# EAGLE design Adafruit PiMiniTFT 240x240 (EAGLE 9.5.2)
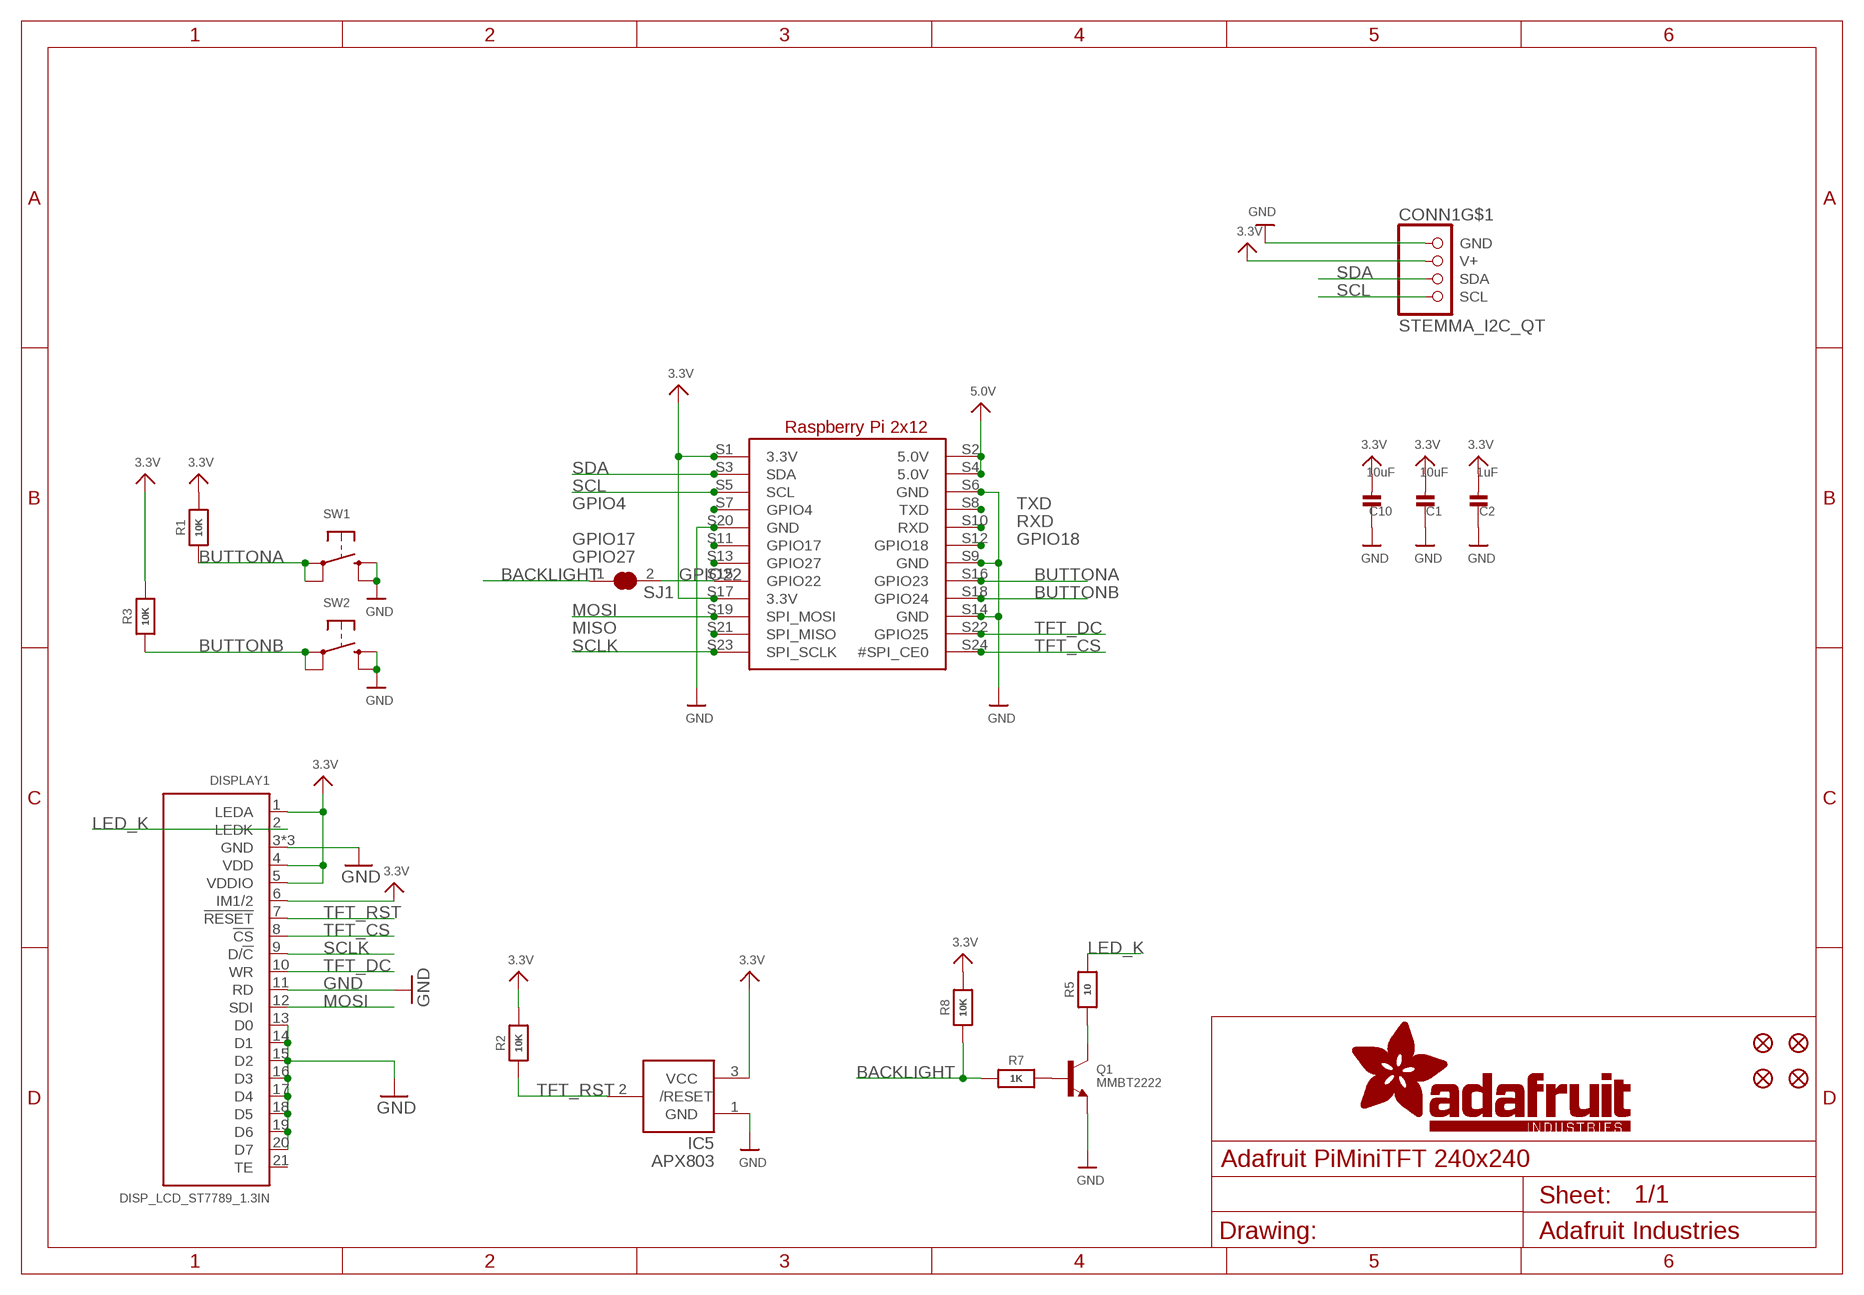
[diagram p0: schematic, sheet 1]

## Parts
C1  10uF  CAP_CERAMIC0805-NOOUTLINE  [0805-NO]
C2  1uF  CAP_CERAMIC0603_NO  [0603-NO]
C10  10uF  CAP_CERAMIC0805-NOOUTLINE  [0805-NO]
CONN1  STEMMA_I2C_QT  [JST_SH4]
DISPLAY1  DISP_LCD_ST7789_1.3IN  [TFT_1.3IN_240X240_24P]
FID1  FIDUCIAL_1MM  [FIDUCIAL_1MM]
FID2  FIDUCIAL_1MM  [FIDUCIAL_1MM]
FID3  FIDUCIAL_1MM  [FIDUCIAL_1MM]
FID4  FIDUCIAL_1MM  [FIDUCIAL_1MM]
IC5  APX803  AXP083-SAG  [SOT23]
Q1  MMBT2222  TRANSISTOR_NPNWIDE  [SOT23-WIDE]
R1  10K  RESISTOR_0603_NOOUT  [0603-NO]
R2  10K  RESISTOR_0603_NOOUT  [0603-NO]
R3  10K  RESISTOR_0603_NOOUT  [0603-NO]
R5  10  RESISTOR_0603_NOOUT  [0603-NO]
R7  1K  RESISTOR_0603_NOOUT  [0603-NO]
R8  10K  RESISTOR_0603_NOOUT  [0603-NO]
RASPI1  RASPBERRYPI_2X12_SMT  [RASPBERRYPI_2X12_SMT]
SJ1  SOLDERJUMPER_CLOSED  [SOLDERJUMPER_CLOSEDWIRE]
SW1  SWITCH_TACT_SMT_EVQQ2_SMALL  [EVQ-Q2_SMALLER]
SW2  SWITCH_TACT_SMT_EVQQ2_SMALL  [EVQ-Q2_SMALLER]

## Nets
3.3V: C1.2 C2.2 C10.2 CONN1.2(V+) DISPLAY1.1(LEDA) DISPLAY1.4(VDD) DISPLAY1.5(VDDIO) DISPLAY1.6(IM1/2) IC5.3(VCC) R1.2 R2.2 R3.2 R8.2 RASPI1.S1(3.3V) RASPI1.S17(3.3V)
5.0V: RASPI1.S2(5.0V) RASPI1.S4(5.0V)
BACKLIGHT: R7.1 R8.1 SJ1.1
BUTTONA: R1.1 RASPI1.S16(GPIO23) SW1.A'(P1) SW1.A(P)
BUTTONB: R3.1 RASPI1.S18(GPIO24) SW2.A'(P1) SW2.A(P)
GND: C1.1 C2.1 C10.1 CONN1.1(GND) DISPLAY1.3(GND) DISPLAY1.11(RD) DISPLAY1.13(D0) DISPLAY1.14(D1) DISPLAY1.15(D2) DISPLAY1.16(D3) DISPLAY1.17(D4) DISPLAY1.18(D5) DISPLAY1.19(D6) DISPLAY1.20(D7) DISPLAY1.23(GND) DISPLAY1.24(GND) IC5.1(GND) Q1.2(E) RASPI1.S6(GND) RASPI1.S9(GND) RASPI1.S14(GND) RASPI1.S20(GND) SW1.B'(S1) SW1.B(S) SW2.B'(S1) SW2.B(S)
GPIO4: RASPI1.S7(GPIO4)
GPIO17: RASPI1.S11(GPIO17)
GPIO18: RASPI1.S12(GPIO18)
GPIO22: RASPI1.S15(GPIO22) SJ1.2
GPIO27: RASPI1.S13(GPIO27)
LED_K: DISPLAY1.2(LEDK) R5.2
MISO: RASPI1.S21(SPI_MISO)
MOSI: DISPLAY1.12(SDI) RASPI1.S19(SPI_MOSI)
N$1: Q1.1(B) R7.2
N$5: Q1.3(C) R5.1
RXD: RASPI1.S10(RXD)
SCL: CONN1.4(SCL) RASPI1.S5(SCL)
SCLK: DISPLAY1.9(D/!C) RASPI1.S23(SPI_SCLK)
SDA: CONN1.3(SDA) RASPI1.S3(SDA)
TFT_CS: DISPLAY1.8(!CS) RASPI1.S24(#SPI_CE0)
TFT_DC: DISPLAY1.10(WR) RASPI1.S22(GPIO25)
TFT_RST: DISPLAY1.7(!RESET) IC5.2(/RESET) R2.1
TXD: RASPI1.S8(TXD)
Unconnected: CONN1.MT1(MT) CONN1.MT2(MT) DISPLAY1.21(TE)

## Library data of the parts
C1 C2 C10 = microbuilder:CAP_CERAMIC: Ceramic Capacitors For new designs, use the packages preceded by an '_' character since they are more reliable: The following footprints should be used on most boards: _0402 - Standard footprint for regular board layouts _0603 - Standard footprint for regular board layouts _0805 - Standard footprint for regular board layouts _1206 - Standard footprint for regular board layouts For extremely tight-pitch boards where space is at a premium, the following 'micro-pitch' footprints can be used (smaller pads, no silkscreen outline, etc.): _0402MP - Micro-pitch footprint for very dense/compact boards _0603MP - Micro-pitch footprint for very dense/compact boards _0805MP - Micro-pitch footprint for very dense/compact boards _1206MP - Micro-pitch footprint for very dense/compact boards
CONN1 = microbuilder:STEMMA_I2C
DISPLAY1 = microbuilder:DISP_LCD_ST7789_1.3IN
FID1-FID4 = microbuilder:FIDUCIAL: Fiducial Alignment Points Various fiducial points for machine vision alignment.; BOM: EXCLUDE
IC5 = adafruit:AXP083
Q1 = microbuilder:TRANSISTOR_NPN: NPN Transistor Transistor (NPN) 500mA 45V - BC817 [Digikey: 568-1631-1-ND] Transistor (NPN) 500mA 45V - BC817,215 [Mouser: 771-BC817-T/R] SOT23-R - SOT23 footprint optimised for use with solder paste and reflow ovens. SOT23-W - SOT23 footprint optimised for hand-soldering (larger pads).
R1-R3 R5 R7 R8 = microbuilder:RESISTOR: Resistors For new designs, use the packages preceded by an '_' character since they are more reliable: The following footprints should be used on most boards: _0402 - Standard footprint for regular board layouts _0603 - Standard footprint for regular board layouts _0805 - Standard footprint for regular board layouts _1206 - Standard footprint for regular board layouts For extremely tight-pitch boards where space is at a premium, the following 'micro-pitch' footprints can be used (smaller pads, no silkscreen outline, etc.): _0402MP - Micro-pitch footprint for very dense/compact boards _0603MP - Micro-pitch footprint for very dense/compact boards _0805MP - Micro-pitch footprint for very dense/compact boards _1206MP - Micro-pitch footprint for very dense/compact boards
RASPI1 = adafruit_sbc:RASPBERRYPI_2X12
SJ1 = microbuilder:SOLDERJUMPER_CLOSED: Solder Jumper - Closed These solder jumpers are closed by default CLOSEDWIRE - 10 mil trace between pads that can be cut and resoldered later CLOSEDPERM - 63 mil trace between pads for a permanent connection (used to 'bridge' two signals, a shameless hack for Eagle). Can double as a test point as well (no cream layer)
SW1 SW2 = microbuilder:SWITCH_TACT_SMT: SMT Tact Switches 6x6mm - Digikey: P12940SCT-ND KMR2 (4.6x2.8mm) - Digikey: 401-1426-1-ND EVQ-PQHB55 - Light Touch, 160GF (4.5x4.5mm) - Digikey: P8090SCT-ND KMT0 - KMT021 NGJ LHS (etc.) IP68/Waterproof - Digikey: CKN10289CT-ND

## Net classes
1 power: width 0.254 mm

## Board
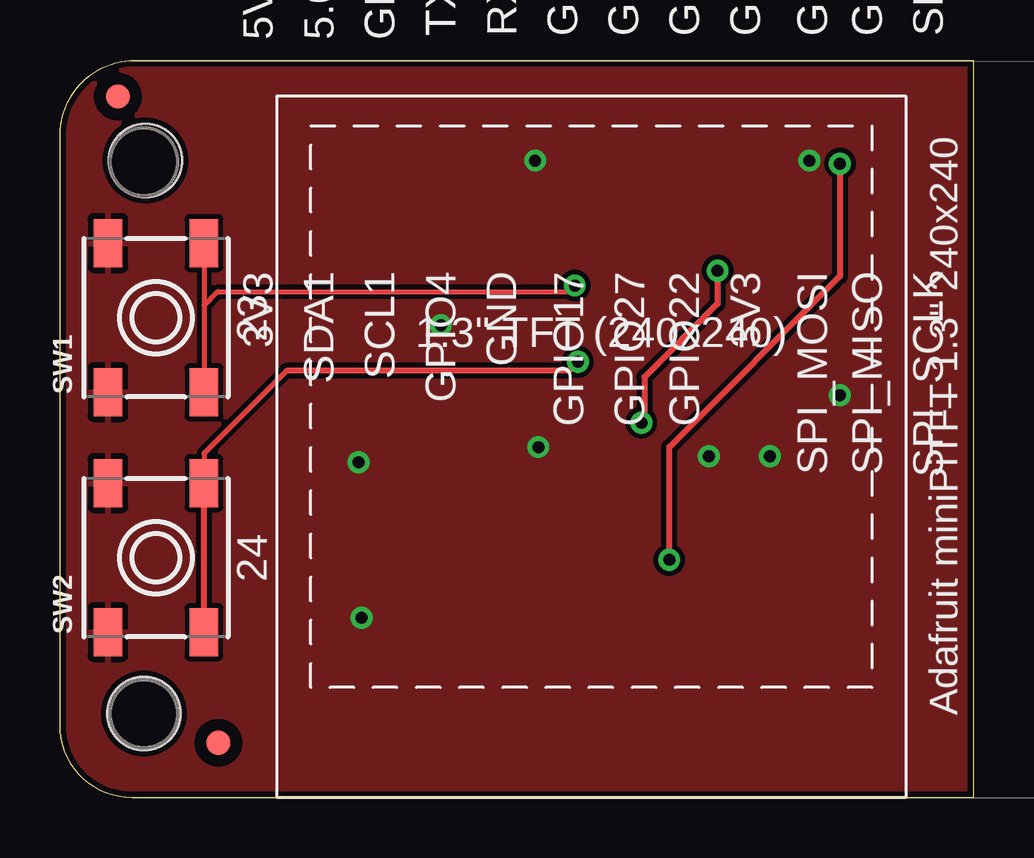
[diagram p1: board, top side]
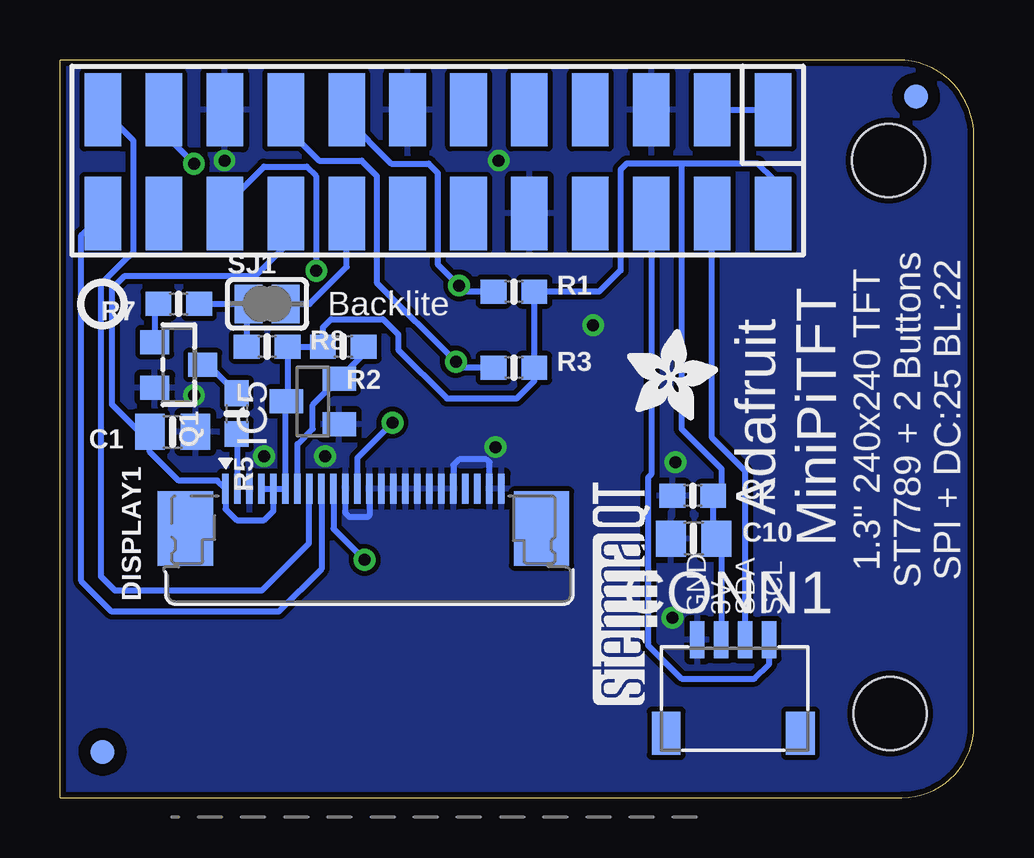
[diagram p2: board, bottom side, seen from below]

Size 38.1 x 30.73 mm. Coordinates in mm from the lower left corner, seen from the top.
Outline: 38.1,0 3,0 arc-90 0,3 0,27.56 arc-90 3.17,30.73 38.1,30.73 38.1,0
Copper layers (1*16): Top 0.035mm / dielectric 1.5mm / Bottom 0.035mm
Design rules "adafruit *": minimum track width 8mil, minimum drill 15.5mil, track to track 8mil, track to pad 8mil, pad to pad 8mil, via to via 8mil, smd to smd 8mil, copper to edge 10mil, drill to drill 8mil, minimum pad ring 10mil, minimum via ring 8mil, stop-mask expansion 2mil, vias tented up to drill 20mil, thermal gap 10mil
Holes 3.05 mm at 3.56,26.54 3.5,3.5

### Footprints (pad centres in the part's own frame; a part is rotated, then mirrored left to right if it is on the bottom)
0805-NO = smd 1.24 x 1.5: 1 -0.95,0; 2 0.95,0
0603-NO = smd 1.075 x 1: 1 -0.85,0; 2 0.85,0
JST_SH4 = smd 0.6 x 1.55: 1 -1.5,2.514; 2 -0.5,2.514; 3 0.5,2.514; 4 1.5,2.514 | smd 1.2 x 1.8: MT1 -2.8,-1.386; MT2 2.8,-1.386
TFT_1.3IN_240X240_24P = smd 0.28 x 1.25: 1 4.55,13.378; 2 5.05,13.378; 3 5.55,13.378; 4 6.05,13.378; 5 6.55,13.378; 6 7.05,13.378; 7 7.55,13.378; 8 8.05,13.378; 9 8.55,13.378; 10 9.05,13.378; 11 9.55,13.378; 12 10.05,13.378; 13 10.55,13.378; 14 11.05,13.378; 15 11.55,13.378; 16 12.05,13.378; 17 12.55,13.378; 18 13.05,13.378; 19 13.55,13.378; 20 14.05,13.378; 21 14.55,13.378; 22 15.05,13.378; 23 15.55,13.378; 24 16.05,13.378 | smd 2.3 x 3.1: MNT1 2.88,11.722; MNT2 17.72,11.722
FIDUCIAL_1MM = smd 1 x 1: 1 0,0
SOT23 = smd 1 x 1.4: 1 -0.95,-1.1; 2 0.95,-1.1; 3 0,1.1
SOT23-WIDE = smd 1 x 1.2: 1 -0.95,-1; 2 0.95,-1; 3 0,1
RASPBERRYPI_2X12_SMT = smd 1.524 x 3.048 bottom: S1 8.37,24.339; S2 8.37,28.657; S3 10.91,24.339; S4 10.91,28.657; S5 13.45,24.339; S6 13.45,28.657; S7 15.99,24.339; S8 15.99,28.657; S9 18.53,24.339; S10 18.53,28.657; S11 21.07,24.339; S12 21.07,28.657; S13 23.61,24.339; S14 23.61,28.657; S15 26.15,24.339; S16 26.15,28.657; S17 28.69,24.339; S18 28.69,28.657; S19 31.23,24.339; S20 31.23,28.657; S21 33.77,24.339; S22 33.77,28.657; S23 36.31,24.339; S24 36.31,28.657
SOLDERJUMPER_CLOSEDWIRE = smd 1.168 x 1.6: 1 -0.762,0; 2 0.762,0 | smd 0.635 x 0.203: WIRE 0,0
EVQ-Q2_SMALLER = smd 2 x 1.2: A -3.1,-2; A' 3.1,-2; B -3.1,2; B' 3.1,2

### Placement (x,y rotation side)
C1  33.4,15.24 180 bottom
C2  11.72,12.57 0 bottom
C10  11.68,10.79 0 bottom
CONN1  10.03,4.06 0 bottom
DISPLAY1  35.75,-0.51 0 bottom
FID1  2.41,29.21 0 top
FID2  6.6,2.29 0 top
FID3  36.32,1.9 0 bottom
FID4  2.41,29.21 0 bottom
IC5  27.56,16.51 90 bottom
Q1  33.15,18.03 270 bottom
R1  19.18,21.08 0 bottom
R2  26.29,18.8 180 bottom
R3  19.18,17.91 0 bottom
R5  30.73,16 270 bottom
R7  33.15,20.57 180 bottom
R8  29.46,18.8 0 bottom
RASPI1  0,0 0 top
SJ1  29.46,20.57 0 bottom
SW1  4,20 90 top
SW2  4,10 90 top
U$4  MICROSD  [ADAFRUIT_3.5MM]  14.47,15.72 0 bottom
U$6  [PCBFEAT-REV-040]  36.32,20.57 0 bottom
U$15  [STEMMAQT]  13.23,3.88 90 bottom

### Tracks (layer width: path | path; a pad name or v marks a point on that pad's centre or on a via)
3.3V
  Bottom 0.254: DISPLAY1.4 DISPLAY1.5 | DISPLAY1.5 DISPLAY1.6 28.7,16.47 IC5.3 28.61,16.55 R8.2 R2.2 27.14,19.6 26.8,19.94 24.64,19.94 24,19.3 24,18.67 21.97,16.64 19.05,16.64 18.33,17.36 R3.2 R1.2 15.62,21.08 14.73,21.97 14.73,26.16 14.48,26.42 12.19,26.42 | DISPLAY1.5 29.2,11.95 29.59,11.56 30.73,11.56 31.2,12.02 DISPLAY1.1 31.54,13.21 33.15,13.21 34.35,14.41 C1.2 34.8,15.24 35.94,16.38 35.94,21.21 35.43,21.72 29.97,21.72 28.69,23 RASPI1.S17 | CONN1.2 10.53,10.59 C10.2 10.87,10.93 C2.2 10.52,12.93 10.52,13.7 12.19,15.37 12.19,26.42 | RASPI1.S1 8.37,25.77 9.02,26.42 12.19,26.42 | RASPI1.S17
5.0V
  Bottom 0.254: RASPI1.S4 RASPI1.S2
BACKLIGHT
  Bottom 0.254: R8.1 30.31,20.49 SJ1.1 R7.1
BUTTONA  (via drill 0.5)
  Top 0.203: SW1.A' 6,20.5 | 6,20.5 SW1.A | 6,20.5 6.58,21.08 21.21,21.08
  Top 0.254: 21.21,21.08 v21.46,21.34
  Bottom 0.254: R1.1 21.21,21.08 v21.46,21.34 22.35,22.23 22.35,26.04 22.73,26.42 24.29,26.42 26.15,28.28 RASPI1.S16
BUTTONB  (via drill 0.5)
  Top 0.203: 9.44,17.78 6,14.34 SW2.A'
  Top 0.254: SW2.A SW2.A' | v21.59,18.16 21.21,17.78 9.44,17.78
  Bottom 0.254: R3.1 21.34,17.91 v21.59,18.16 24.89,21.46 24.89,25.91 25.53,26.54 27.3,26.54 28.69,27.93 RASPI1.S18 | RASPI1.S18
GND  (via drill 0.5)
  Bottom 0.254: DISPLAY1.13 25.2,11.76 25.27,11.68 26.03,11.68 26.2,11.85 DISPLAY1.11 | DISPLAY1.23 20.19,13.97 20.32,14.1 21.46,14.1 21.7,13.86 DISPLAY1.20
  other vias: 12.45,13.97 12.57,7.49 19.94,14.61 29.59,14.22 27.05,14.22 15.88,19.69 32.51,16.76 19.81,26.54 31.24,26.54
  pour Bottom: 0,30.73 37.97,30.73 37.97,0 0,0
  pour Top: 0,30.73 37.97,30.73 37.97,0 0,0
GPIO22
  Bottom 0.254: SJ1.2 27.69,20.57 26.15,22.11 RASPI1.S15
LED_K
  Bottom 0.254: DISPLAY1.2 30.7,15.12 R5.2
MOSI  (via drill 0.5)
  Top 0.254: v24.24,15.62 24.36,15.75 24.36,17.52 27.41,20.57 v27.41,21.95
  Bottom 0.254: DISPLAY1.12 25.7,14.16 v24.24,15.62 | RASPI1.S19 31.23,24.65 29.59,26.29 27.81,26.29 27.43,25.91 27.43,22.23 27.56,22.1 v27.41,21.95
N$1
  Bottom 0.254: R7.2 34.15,20.42 Q1.1
N$5
  Bottom 0.254: R5.1 31.92,18.03 Q1.3
SCL
  Bottom 0.254: CONN1.4 8.53,5.56 9.14,4.95 12.19,4.95 13.45,6.21 13.58,6.34 13.58,13.33 13.45,13.47 RASPI1.S5
SCLK
  Bottom 0.254: DISPLAY1.9 27.2,9.52 28.98,7.75 35.94,7.75 37.21,9.02 37.21,23.44 RASPI1.S23
SDA
  Bottom 0.254: CONN1.3 9.53,13.6 10.92,14.99 10.92,24.33 RASPI1.S3
TFT_CS
  Bottom 0.254: DISPLAY1.8 27.73,12.84 27.73,10.58 29.68,8.64 35.81,8.64 36.4,9.22 36.4,21.4 35.24,22.55 35.23,22.55 35.05,22.73 35.05,27.4 RASPI1.S24
TFT_DC  (via drill 0.5)
  Top 0.254: v25.4,9.91 25.4,14.61 32.51,21.72 v32.51,26.42
  Bottom 0.254: DISPLAY1.10 26.7,11.21 v25.4,9.91 | RASPI1.S22 33.77,27.67 v32.51,26.42
TFT_RST
  Bottom 0.254: R2.1 25.44,18.48 IC5.2 27.56,16.36 27.56,15.37 28.2,14.73 DISPLAY1.7

### Text on the board
tPlace: 23 | Adafruit miniPiTFT 1.3" 240x240 | 24
bPlace: Backlite | Adafruit / MiniPiTFT | 1.3" 240x240 TFT / ST7789 + 2 Buttons / SPI + DC:25 BL:22 | SCL | SDA | 3V | GND